# Altium schematic sheet Placa_FdC_v2.SchDoc
size A3
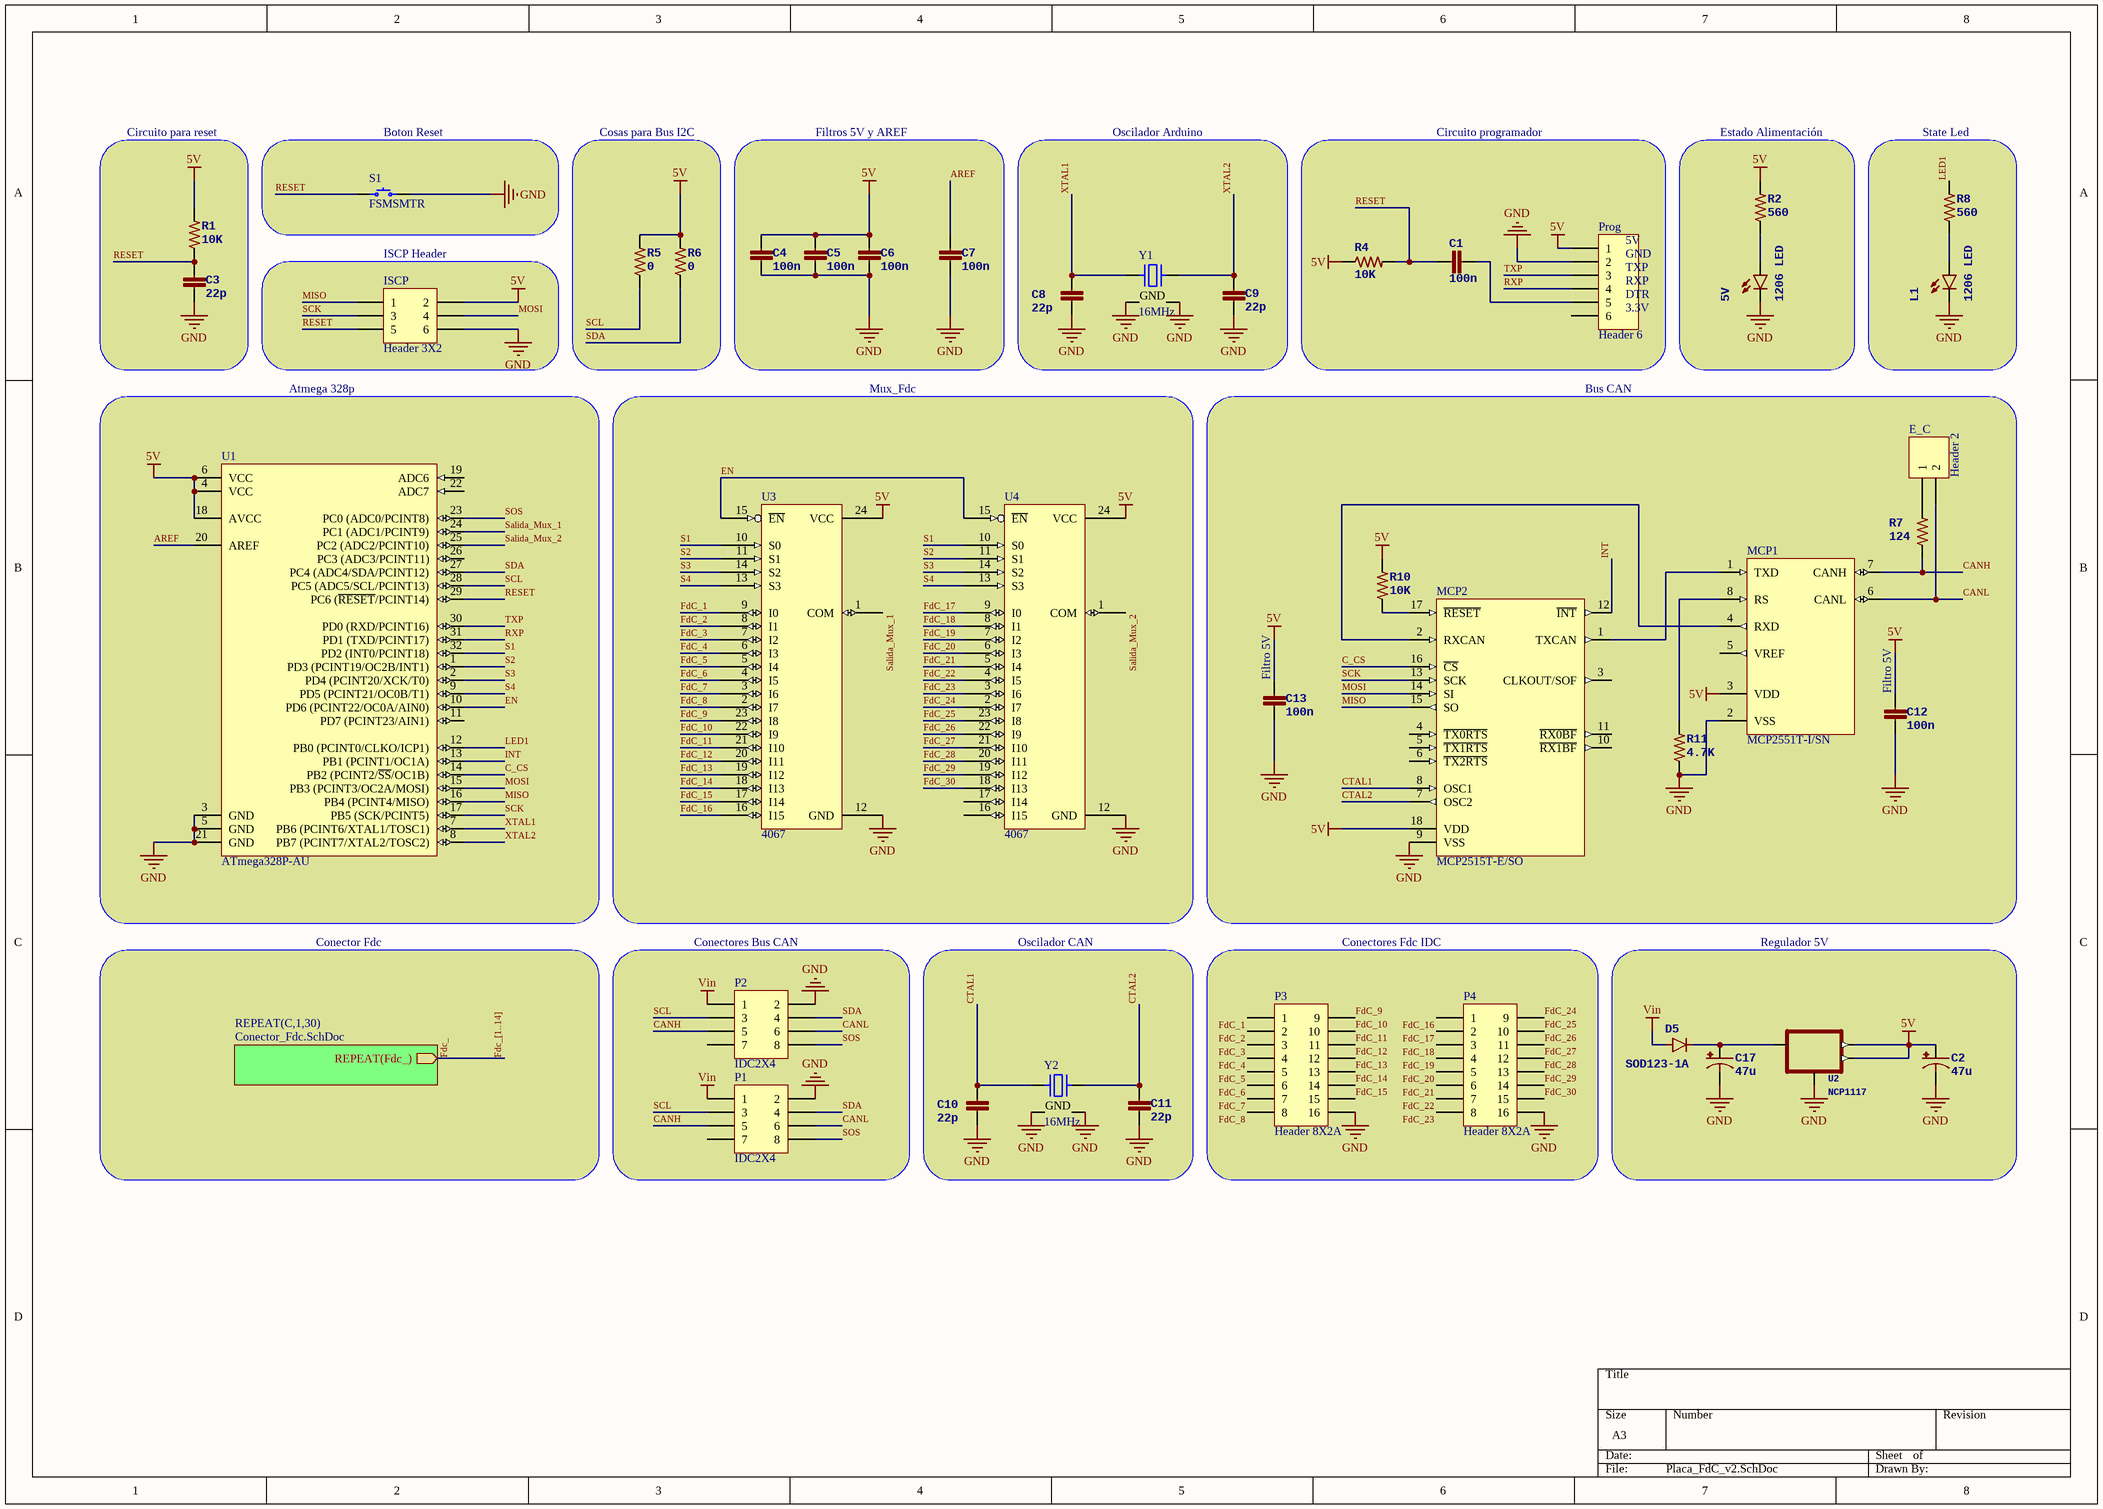
[diagram p0: Placa_FdC_v2.SchDoc]

## Parts
5V  1206 LED  [LED-1206]
C1  100n  [0805]
C2  47u  [PANASONIC_D]
C3  22p  [0805]
C4  100n  [0805]
C5  100n  [0805]
C6  100n  [0805]
C7  100n  [0805]
C8  22p  [0805]
C9  22p  [0805]
C10  22p  [0805]
C11  22p  [0805]
C12  100n  [0805]
C13  100n  [0805]
C17  47u  [PANASONIC_D]
D5  SOD123-1A  [SOD-123]
E_C  Header 2  [HDR1X2]
ISCP  Header 3X2  [HDR2X3]
L1  1206 LED  [LED-1206]
MCP1  MCP2551T-I/SN  [SOIC-SN8_N]
MCP2  MCP2515T-E/SO  [SOIC-SO18_N]
P1  IDC2X4  [IDC2X4]
P2  IDC2X4  [IDC2X4]
P3  Header 8X2A  [HDR2X8_CEN]
P4  Header 8X2A  [HDR2X8_CEN]
Prog  Header 6  [HDR1X6]
R1  10K  [0805]
R2  560  [0805]
R4  10K  [0805]
R5  0  [0805]
R6  0  [0805]
R7  124  [0805]
R8  560  [0805]
R10  10K  [0805]
R11  4.7K  [0805]
S1  FSMSMTR  [TE FSMSMTR]
U1  ATmega328P-AU  [32A_N]
U2  NCP1117  [SOT223]
U3  4067  [SSOP-24]
U4  4067  [SSOP-24]
Y1  16MHz  [NDK NX3225SA]
Y2  16MHz  [NDK NX3225SA]

## Blocks framed on the sheet
Circuito para reset: C3 R1
Boton Reset: S1
Cosas para Bus I2C: R5 R6
Filtros 5V y AREF: C4-C7
Oscilador Arduino: C8 C9 Y1
Estado Alimentación: 5V R2
State Led: L1 R8
ISCP Header: ISCP
Atmega 328p: U1
Mux_Fdc: U3 U4
Conectores Bus CAN: P1 P2
Oscilador CAN: C10 C11 Y2
Conectores Fdc IDC: P3 P4
Regulador 5V: C2 C17 D5 U2

## Sub-sheets
REPEAT(C,1,30) = Conector_Fdc.SchDoc: REPEAT(Fdc_) (out)

## Nets
5V: C2.+ C4.1 C5.1 C6.1 C12.1 C13.1 ISCP.2 MCP1.3(VDD) MCP2.18(VDD) Prog.1 R1.2 R2.2 R4.1 R5.2 R6.2 R10.2 U1.4(VCC) U1.6(VCC) U1.18(AVCC) U2.2(OUT) U2.4(OUT@1) U3.24(VCC) U4.24(VCC)
GND: 5V.C C2.- C3.2 C4.2 C5.2 C6.2 C7.2 C8.2 C9.2 C10.2 C11.2 C12.2 C13.2 C17.- ISCP.6 L1.C MCP1.2(VSS) MCP2.9(VSS) P1.2 P2.2 P3.16 P4.16 Prog.2 R11.1 S1.2 U1.3(GND) U1.5(GND) U1.21(GND) U2.1(ADJ) U3.12(GND) U4.12(GND) Y1.2(GND) Y1.4(GND) Y2.2(GND) Y2.4(GND)
Vin: D5.A P1.1 P2.1
AREF: C7.1 U1.20(AREF)
C_CS: MCP2.16(~{CS}) U1.14(PB2_(PCINT2/~{SS}/OC1B))
CANH: MCP1.7(CANH) P1.5 P2.5 R7.1
CANL: E_C.2 MCP1.6(CANL) P1.6 P2.6
CTAL1: C10.1 MCP2.8(OSC1) Y2.1
CTAL2: C11.1 MCP2.7(OSC2) Y2.3
EN: U1.10(PD6_(PCINT22/OC0A/AIN0)) U3.15(~{EN}) U4.15(~{EN})
Fdc_: sheet REPEAT(C,1,30)/REPEAT(Fdc_)
FdC_1: P3.1 U3.9(I0)
FdC_2: P3.2 U3.8(I1)
FdC_3: P3.3 U3.7(I2)
FdC_4: P3.4 U3.6(I3)
FdC_5: P3.5 U3.5(I4)
FdC_6: P3.6 U3.4(I5)
FdC_7: P3.7 U3.3(I6)
FdC_8: P3.8 U3.2(I7)
FdC_9: P3.9 U3.23(I8)
FdC_10: P3.10 U3.22(I9)
FdC_11: P3.11 U3.21(I10)
FdC_12: P3.12 U3.20(I11)
FdC_13: P3.13 U3.19(I12)
FdC_14: P3.14 U3.18(I13)
FdC_15: P3.15 U3.17(I14)
FdC_16: P4.1 U3.16(I15)
FdC_17: P4.2 U4.9(I0)
FdC_18: P4.3 U4.8(I1)
FdC_19: P4.4 U4.7(I2)
FdC_20: P4.5 U4.6(I3)
FdC_21: P4.6 U4.5(I4)
FdC_22: P4.7 U4.4(I5)
FdC_23: P4.8 U4.3(I6)
FdC_24: P4.9 U4.2(I7)
FdC_25: P4.10 U4.23(I8)
FdC_26: P4.11 U4.22(I9)
FdC_27: P4.12 U4.21(I10)
FdC_28: P4.13 U4.20(I11)
FdC_29: P4.14 U4.19(I12)
FdC_30: P4.15 U4.18(I13)
INT: MCP2.12(~{INT}) U1.13(PB1_(PCINT1/OC1A))
LED1: R8.2 U1.12(PB0_(PCINT0/CLKO/ICP1))
MISO: ISCP.1 MCP2.15(SO) U1.16(PB4_(PCINT4/MISO))
MOSI: ISCP.4 MCP2.14(SI) U1.15(PB3_(PCINT3/OC2A/MOSI))
RESET: C1.1 C3.1 ISCP.5 R1.1 R4.2 S1.1 U1.29(PC6_(~{RESET}/PCINT14))
RXP: Prog.4 U1.31(PD1_(TXD/PCINT17))
S1: U1.32(PD2_(INT0/PCINT18)) U3.10(S0) U4.10(S0)
S2: U1.1(PD3_(PCINT19/OC2B/INT1)) U3.11(S1) U4.11(S1)
S3: U1.2(PD4_(PCINT20/XCK/T0)) U3.14(S2) U4.14(S2)
S4: U1.9(PD5_(PCINT21/OC0B/T1)) U3.13(S3) U4.13(S3)
Salida_Mux_1: U1.24(PC1_(ADC1/PCINT9)) U3.1(COM)
Salida_Mux_2: U1.25(PC2_(ADC2/PCINT10)) U4.1(COM)
SCK: ISCP.3 MCP2.13(SCK) U1.17(PB5_(SCK/PCINT5))
SCL: P1.3 P2.3 R5.1 U1.28(PC5_(ADC5/SCL/PCINT13))
SDA: P1.4 P2.4 R6.1 U1.27(PC4_(ADC4/SDA/PCINT12))
SOS: P1.8 P2.8 U1.23(PC0_(ADC0/PCINT8))
TXP: Prog.3 U1.30(PD0_(RXD/PCINT16))
XTAL1: C8.1 U1.7(PB6_(PCINT6/XTAL1/TOSC1)) Y1.1
XTAL2: C9.1 U1.8(PB7_(PCINT7/XTAL2/TOSC2)) Y1.3
Net5V_A: 5V.A R2.1
NetC1_2: C1.2 Prog.5
NetC17_+: C17.+ D5.C U2.3(IN)
NetE_C_1: E_C.1 R7.2
NetL1_A: L1.A R8.1
NetMCP1_1: MCP1.1(TXD) MCP2.1(TXCAN)
NetMCP1_4: MCP1.4(RXD) MCP2.2(RXCAN)
NetMCP1_8: MCP1.8(RS) R11.2
NetMCP2_17: MCP2.17(~{RESET}) R10.1

Not connected (* = marked no-connect by the designer): MCP1 5(VREF); MCP2 3(CLKOUT/SOF) 4(~{TX0RTS}) 5(~{TX1RTS}) 6(~{TX2RTS}) 10(~{RX1BF}) 11(~{RX0BF}); P1 7; P2 7; Prog 6; U1 11(PD7_(PCINT23/AIN1)) 19(ADC6) 22(ADC7) 26(PC3_(ADC3/PCINT11)); U4 16(I15) 17(I14)

## Buses and harness runs
bus Fdc_[1..14]

## Notes on the sheet
- Circuito programador
- (near Prog) 5V
- (near Prog) GND
- (near Prog) TXP
- (near Prog) RXP
- (near Prog) DTR
- (near Prog) 3.3V
- Bus CAN
- (near C13) Filtro 5V
- (near C12) Filtro 5V
- Conector Fdc

## Library data of the parts
5V L1 = LED1206
C1 C3-C13 = CAP0805
C2 C17 = 47UF-50V-20%(ELECT): PROD_ID: CAP-10547
D5 = DIODESOD123
E_C = Header 2: Header, 2-Pin; LatestRevisionDate: 17-Jul-2002; LatestRevisionNote: Re-released for DXP Platform.; Publisher: Altium Limited
ISCP = Header 3X2: Header, 3-Pin, Dual row; LatestRevisionDate: 17-Jul-2002; LatestRevisionNote: Re-released for DXP Platform.; Publisher: Altium Limited
MCP1 = MCP2551T-I/SN: High-Speed CAN Transceiver, 8-Pin SOIC, Industrial Temperature, Tape and Reel; Published: 29-Jan-2009; DatasheetVersion: revE, Jan-2007; PackageVersion: revBB, Aug-2009; PackageReference: SOIC-SN8; Publisher: Altium Limited; PackageDescription: 8-Lead Plastic Small Outline (SN) - Narrow, 3.90mm Body [SOIC]; Supplier 1: Digi-Key; Supplier Part Number 1: MCP2551T-I/SNTR-ND; Supplier 2: Farnell; Supplier Part Number 2: 1788569; Code_JEDEC: MS-012; Code_IPC: SOIC127P600-8; ComponentLink1Description: Datasheet; ComponentLink1URL: http://ww1.microchip.com/downloads/en/DeviceDoc/21667E.pdf; ComponentLink2Description: Packaging Specification; ComponentLink2URL: http://www.microchip.com/stellent/groups/techpub_sg/documents/packagingspec/en012702.pdf; ComponentLink3Description: Microchip.com Home; ComponentLink3URL: http://www.microchip.com/
MCP2 = MCP2515T-E/SO: Stand-Alone CAN Controller With SPI Interface, 18-Pin SOIC, Extended Temperature, Tape and Reel; Published: 29-Jan-2009; DatasheetVersion: revE, Nov-2007; PackageVersion: revBB, Aug-2009; PackageReference: SOIC-SO18; Publisher: Altium Limited; PackageDescription: 18-Lead Plastic Small Outline (SO) - Wide 7.50mm Body [SOIC]; Supplier 1: Digi-Key; Supplier Part Number 1: MCP2515T-E/SO-ND; Code_JEDEC: MS-013; ComponentLink1Description: Datasheet; ComponentLink1URL: http://ww1.microchip.com/downloads/en/DeviceDoc/21801e.pdf; ComponentLink2Description: Packaging Specification; ComponentLink2URL: http://www.microchip.com/stellent/groups/techpub_sg/documents/packagingspec/en012702.pdf; ComponentLink3Description: Microchip.com Home; ComponentLink3URL: http://www.microchip.com/
P1 P2 = IDC2X4: Header, 4-Pin, Dual row; LatestRevisionDate: 17-Jul-2002; LatestRevisionNote: Re-released for DXP Platform.; Publisher: Altium Limited
P3 P4 = Header 8X2A: Header, 8-Pin, Dual row; LatestRevisionDate: 17-Jul-2002; LatestRevisionNote: Re-released for DXP Platform.; Publisher: Altium Limited
Prog = Header 6: Header, 6-Pin; LatestRevisionDate: 17-Jul-2002; LatestRevisionNote: Re-released for DXP Platform.; Publisher: Altium Limited
R1 R2 R4-R8 R10 R11 = RESISTOR0805-RES
S1 = FSMSMTR: SWITCH TACTILE SPST-NO 0.05A 24V; Manufacturer: TE Connectivity Alcoswitch Switches; Switch Function: Off-Mom; Contact Rating @ Voltage: 0.05A @ 24VDC; Actuator Type: Standard; Actuator Orientation: Top Actuated; Illumination: Non-Illuminated; Operating Force: 180gf; Switch Travel: 0.25mm; Mechanical Life: 20,000 Cycles; Part Number: FSMSMTR; PartId: 8251; Supplier 1: Digi-Key; Supplier Part Number 1: 450-1758-2-ND; ComponentLink1Description: Datasheet; ComponentLink1URL: http://www.te.com/commerce/DocumentDelivery/DDEController?Action=srchrtrv&DocNm=1437566-3&DocType=Customer+Drawing&DocLang=English; ComponentLink2Description: Digi-Key Listing; ComponentLink2URL: http://www.digikey.com/product-detail/en/FSMSMTR/450-1758-2-ND/529671; Price: 0,175; Circuit: SPST-NO; Illumination Voltage: -; Illumination Type, Colour: -; Operating Temperature: -35C ~ 85C
U1 = ATmega328P-AU: 8-bit AVR Microcontroller, 32KB Flash, 1KB EEPROM, 2KB SRAM, 32-pin TQFP, Industrial Grade (-40°C to 85°C); Published: 1-Apr-2010; DatasheetVersion: revA, Jan-2010; PackageVersion: revB, Oct-2001; PackageReference: 32A; Publisher: Altium Limited; PackageDescription: 32-Lead, 7x7x1.0 mm Body, 0.8mm Lead Pitch, Thin Profile Plastic Quad Flat Package (TQFP); Supplier 1: Digi-Key; Supplier Part Number 1: ATMEGA328P-AU-ND; Supplier 2: Farnell; Supplier Part Number 2: 1715486; Supplier 3: Mouser; Supplier Part Number 3: 556-ATMEGA328P-AU; Code_JEDEC: MS-026-ABA; ComponentLink1Description: Manufacturer Link; ComponentLink1URL: http://www.atmel.com/products/avr/default.asp?; ComponentLink2Description: ATmega48A/48PA/88A/88PA/168A/168PA/328/328P Datasheet; ComponentLink2URL: http://www.atmel.com/dyn/resources/prod_documents/8271.pdf; ComponentLink3Description: ATmega48A/48PA/88A/88PA/168A/168PA/328/328P Summary; ComponentLink3URL: http://www.atmel.com/dyn/resources/prod_documents/8271S.pdf; ComponentLink4Description: Atmel.com Home; ComponentLink4URL: http://www.atmel.com
U2 = V_REG_LM1117SOT223: PROD_ID: VREG-08170
U3 U4 = MUX-74HC4067
Y1 Y2 = NX3225SA-16.000MHZ-STD-CSR-1: CRYSTAL 16.0000MHZ 8PF SMD; Manufacturer: NDK; Frequency Stability: 15ppm; ESR: 80 Ohm; Operating Mode: Fundamental; Part Number: NX3225SA-16.000MHZ-STD-CSR-1; PartId: 8509; Supplier 1: Digi-Key; Supplier Part Number 1: 644-1049-2-ND; ComponentLink1Description: Datasheet; ComponentLink1URL: http://media.digikey.com/pdf/Data%20Sheets/NDK%20PDFs/NX3225SA.pdf; ComponentLink2Description: Digi-Key Listing; ComponentLink2URL: http://www.digikey.com/product-detail/en/NX3225SA-16.000MHZ-STD-CSR-1/644-1049-2-ND/1128831; Price: 0,3799; Type: MHz Crystal; Device Package: 4-SMD, No Lead (DFN, LCC); Frequency: 16MHz; Frequency Tolerance: 15ppm; Load Capacitance: 8pF